# Altium schematic sheet MCU.SchDoc
size A4; SheetNumber: 2; SheetTotal: 4
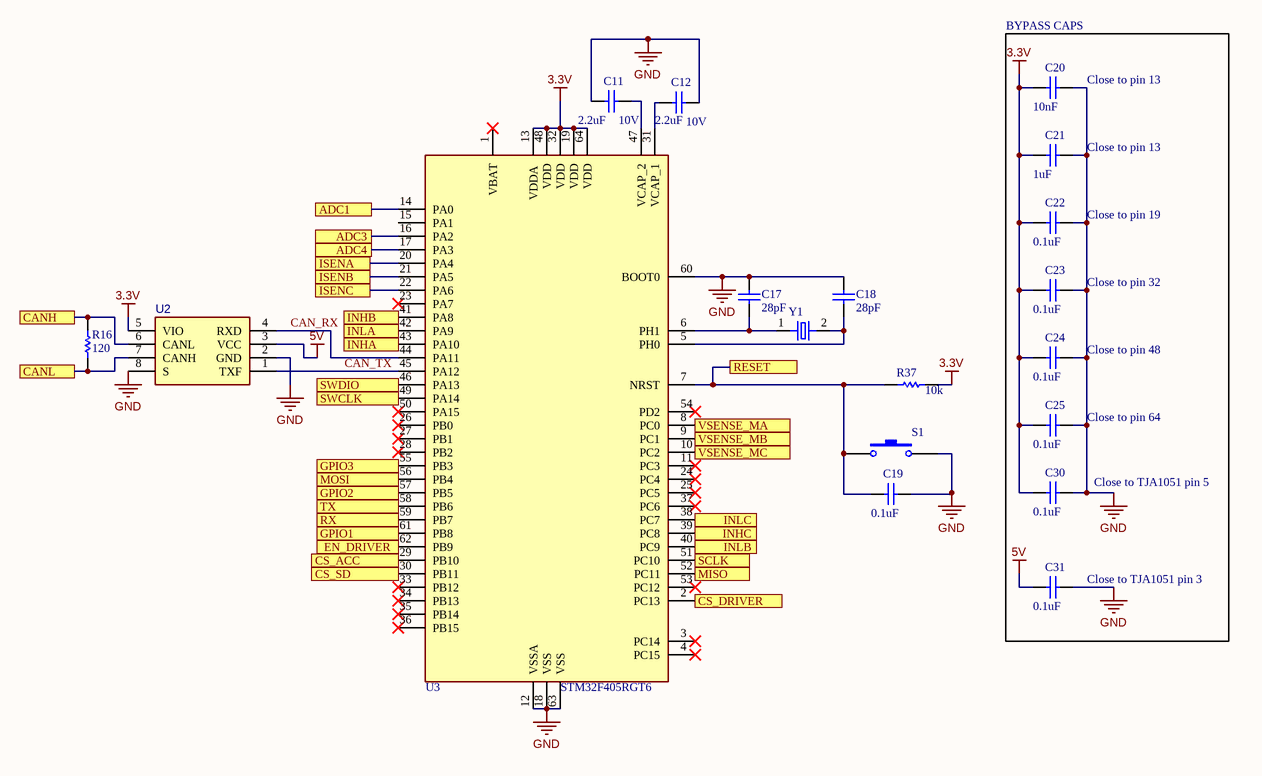
[diagram p0: MCU.SchDoc]

## Parts
C11  10V  value 2.2uF  [0805 - Capacitor]
C12  10V  value 2.2uF  [0805 - Capacitor]
C17  value 28pF  [0805 - Capacitor]  (hidden comment: 100V)
C18  value 28pF  [0805 - Capacitor]  (hidden comment: 100V)
C19  value 0.1uF  [0805 - Capacitor]  (hidden comment: 100V)
C20  value 10nF  [0805 - Capacitor]  (hidden comment: 10V)
C21  value 1uF  [0805 - Capacitor]  (hidden comment: 100V)
C22  value 0.1uF  [0805 - Capacitor]  (hidden comment: 100V)
C23  value 0.1uF  [0805 - Capacitor]  (hidden comment: 100V)
C24  value 0.1uF  [0805 - Capacitor]  (hidden comment: 100V)
C25  value 0.1uF  [0805 - Capacitor]  (hidden comment: 100V)
C30  value 0.1uF  [0805 - Capacitor]  (hidden comment: 100V)
C31  value 0.1uF  [0805 - Capacitor]  (hidden comment: 100V)
R16  value 120  [0603 - Resistor]  (hidden comment: 500m)
R37  10k  [0603 - Resistor]
S1  Switch - Push Button  [6x6mm Switch]  (value not drawn)
U2  (no value)  [TJA1051T/3,118]
U3  STM32F405RGT6  [STM32F405RG]
Y1  ABM3-16.000MHZ-B2-T  [ABM3-16.000MHZ-B2-T]  (value not drawn)

## Ports
ADC1, ADC3, ADC4, CANH, CANL, CS_ACC, CS_DRIVER, CS_SD, EN_DRIVER, GPIO1, GPIO2, GPIO3, INHA, INHB, INHC, INLA, INLB, INLC, ISENA, ISENB, ISENC, MISO, MOSI, RESET, RX, SCLK, SWCLK, SWDIO, TX, VSENSE_MA, VSENSE_MB, VSENSE_MC

## Nets
3.3V: C20.1 C21.1 C22.1 C23.1 C24.1 C25.1 C30.1 R37.1 U2.5(VIO) U3.13(VDDA) U3.19(VDD) U3.32(VDD) U3.48(VDD) U3.64(VDD)
5V: C31.1 U2.3(VCC)
GND: C11.1 C12.2 C17.2 C18.2 C19.2 C20.2 C21.2 C22.2 C23.2 C24.2 C25.2 C30.2 C31.2 S1.2 U2.2(GND) U2.8(S) U3.12(VSSA) U3.18(VSS) U3.60(BOOT0) U3.63(VSS)
ADC1: U3.14(PA0) ; port ADC1
ADC3: U3.16(PA2) ; port ADC3
ADC4: U3.17(PA3) ; port ADC4
CAN_RX: U2.4(RXD) U3.44(PA11)
CAN_TX: U2.1(TXF) U3.45(PA12)
CANH: R16.1 U2.6(CANL) ; port CANH
CANL: R16.2 U2.7(CANH) ; port CANL
CS_ACC: U3.29(PB10) ; port CS_ACC
CS_DRIVER: U3.2(PC13) ; port CS_DRIVER
CS_SD: U3.30(PB11) ; port CS_SD
EN_DRIVER: U3.62(PB9) ; port EN_DRIVER
GPIO1: U3.61(PB8) ; port GPIO1
GPIO2: U3.57(PB5) ; port GPIO2
GPIO3: U3.55(PB3) ; port GPIO3
INHA: U3.43(PA10) ; port INHA
INHB: U3.41(PA8) ; port INHB
INHC: U3.39(PC8) ; port INHC
INLA: U3.42(PA9) ; port INLA
INLB: U3.40(PC9) ; port INLB
INLC: U3.38(PC7) ; port INLC
ISENA: U3.20(PA4) ; port ISENA
ISENB: U3.21(PA5) ; port ISENB
ISENC: U3.22(PA6) ; port ISENC
MISO: U3.52(PC11) ; port MISO
MOSI: U3.56(PB4) ; port MOSI
RESET: C19.1 R37.2 S1.1 U3.7(NRST) ; port RESET
RX: U3.59(PB7) ; port RX
SCLK: U3.51(PC10) ; port SCLK
SWCLK: U3.49(PA14) ; port SWCLK
SWDIO: U3.46(PA13) ; port SWDIO
TX: U3.58(PB6) ; port TX
VSENSE_MA: U3.8(PC0) ; port VSENSE_MA
VSENSE_MB: U3.9(PC1) ; port VSENSE_MB
VSENSE_MC: U3.10(PC2) ; port VSENSE_MC
NetC11_2: C11.2 U3.47(VCAP_2)
NetC12_1: C12.1 U3.31(VCAP_1)
NetC17_1: C17.1 U3.6(PH1) Y1.1
NetC18_1: C18.1 U3.5(PH0) Y1.2

Not connected (* = marked no-connect by the designer): U3 1(VBAT)* 3(PC14)* 4(PC15)* 11(PC3)* 15(PA1) 23(PA7)* 24(PC4)* 25(PC5)* 26(PB0)* 27(PB1)* 28(PB2)* 33(PB12)* 34(PB13)* 35(PB14)* 36(PB15)* 37(PC6)* 50(PA15)* 53(PC12)* 54(PD2)*

## Notes on the sheet
- BYPASS CAPS
- (near C20) Close to pin 13
- (near C21) Close to pin 13
- (near C22) Close to pin 19
- (near C23) Close to pin 32
- (near C24) Close to pin 48
- (near C25) Close to pin 64
- (near C30) Close to TJA1051 pin 5
- (near C31) Close to TJA1051 pin 3
- Title:
- Size:
- Date:
- A4
- Author:
- Revision:
- Sheet
- of
- File:

## Library data of the parts
C11 C12 = Capacitor - Nonpolarized: Nonpolarized Capacitor; Supplier Part Number: *; Supplier: *; Manufacturer: *; Rating: *; Manufacturer Part Number: *
C17-C19 C22-C25 C30 C31 = Capacitor - Nonpolarized: CL21B104KCFNNNE, MULTILAYER CERAMIC CAPACITORS MLCC - SMD/SMT 100NF 100V 0805 ROHS; Supplier Part Number: *; Supplier: *; Manufacturer: *; Rating: *; Manufacturer Part Number: *
C20 = Capacitor - Nonpolarized: C0805C103K8RAC7800. 10000pF ±10% 10V Ceramic Capacitor X7R 0805 (2012 Metric) /; Supplier Part Number: *; Supplier: *; Manufacturer: *; Rating: *; Manufacturer Part Number: *
C21 = Capacitor - Nonpolarized: TDK C2012X7S2A105KT000N, 1UF ±10% 100V X7S 0805 MULTILAYER CERAMIC CAPACITORS MLCC - SMD/SMT ROHS; Supplier Part Number: *; Supplier: *; Manufacturer: *; Rating: *; Manufacturer Part Number: *
R16 R37 = Resistor: Rating: *; Manufacturer Part Number: *; Manufacturer: *; Supplier Part Number: *; Supplier: *
  R37: Value: 10k
S1 = Switch - Push Button: Push Button Switch; Supplier: *; Manufacturer Part Number: *; Manufacturer: *; Supplier Part Number: *; Rating: *; Value: *
U2 = TJA1051T_3,118: Integrated Circuit; Manufacturer_Name: NXP; Datasheet Link: http://www.nxp.com/docs/en/data-sheet/TJA1051.pdf; Height: 1.75mm; Manufacturer_Part_Number: TJA1051T/3,118; Arrow Part Number: TJA1051T/3,118; Arrow Price/Stock: https://www.arrow.com/en/products/tja1051t3118/nxp-semiconductors; Mouser Part Number: 771-TJA1051T3118; Mouser Price/Stock: https://www.mouser.co.uk/ProductDetail/NXP-Semiconductors/TJA1051T-3118?qs=O%2F7ihdSJpebv1PFlp05wnQ%3D%3D
U3 = STM32F405RGT6: ST 64-pin Micro; Manufacturer Part Number: STM32F405RG; Manufacturer: ST; Supplier Part Number: 497-11767-ND; Supplier: Digikey; ComponentLink1Description: Datsheet; ComponentLink1URL: https://www.st.com/content/ccc/resource/technical/document/datasheet/ef/92/76/6d/bb/c2/4f/f7/DM00037051.pdf/files/DM00037051.pdf/jcr:content/translations/en.DM00037051.pdf
Y1 = ABM3-16.000MHZ-B2-T: 16MHz Â±20ppm Crystal 18pF 40 Ohms 2-SMD, No Lead; MF: Abracon; Value: *; MP: ABM3-16.000MHZ-B2-T; Package: SMD-2 Abracon; SnapEDA_Link: https://www.snapeda.com/parts/ABM3-16.000MHZ-B2-T/Abracon%20LLC/view-part/55266/?ref=snap; Digi-Key_Part_Number: 535-9103-1-ND; Digi-Key_Purchase_URL: https://www.digikey.com/product-detail/en/abracon-llc/ABM3-16.000MHZ-B2-T/535-9103-1-ND/675620?utm_source=snapeda&utm_medium=aggregator&utm_campaign=symbol